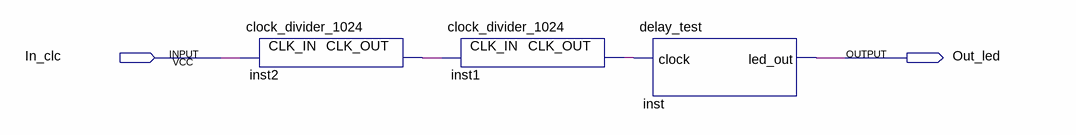
[diagram p0: schematic sheet]
// Quartus schematic dela_led_blink.bdf as structural Verilog: 3 symbols, 2 pins
module dela_led_blink (
  input  In_clc,
  output Out_led
);

  wire inst1_clk_out, inst2_clk_out;

  clock_divider_1024 inst2 (.CLK_IN(In_clc), .CLK_OUT(inst2_clk_out));
  clock_divider_1024 inst1 (.CLK_IN(inst2_clk_out), .CLK_OUT(inst1_clk_out));
  delay_test inst (.clock(inst1_clk_out), .led_out(Out_led));
endmodule
